# EAGLE design Mainboard (EAGLE 7.7.0)
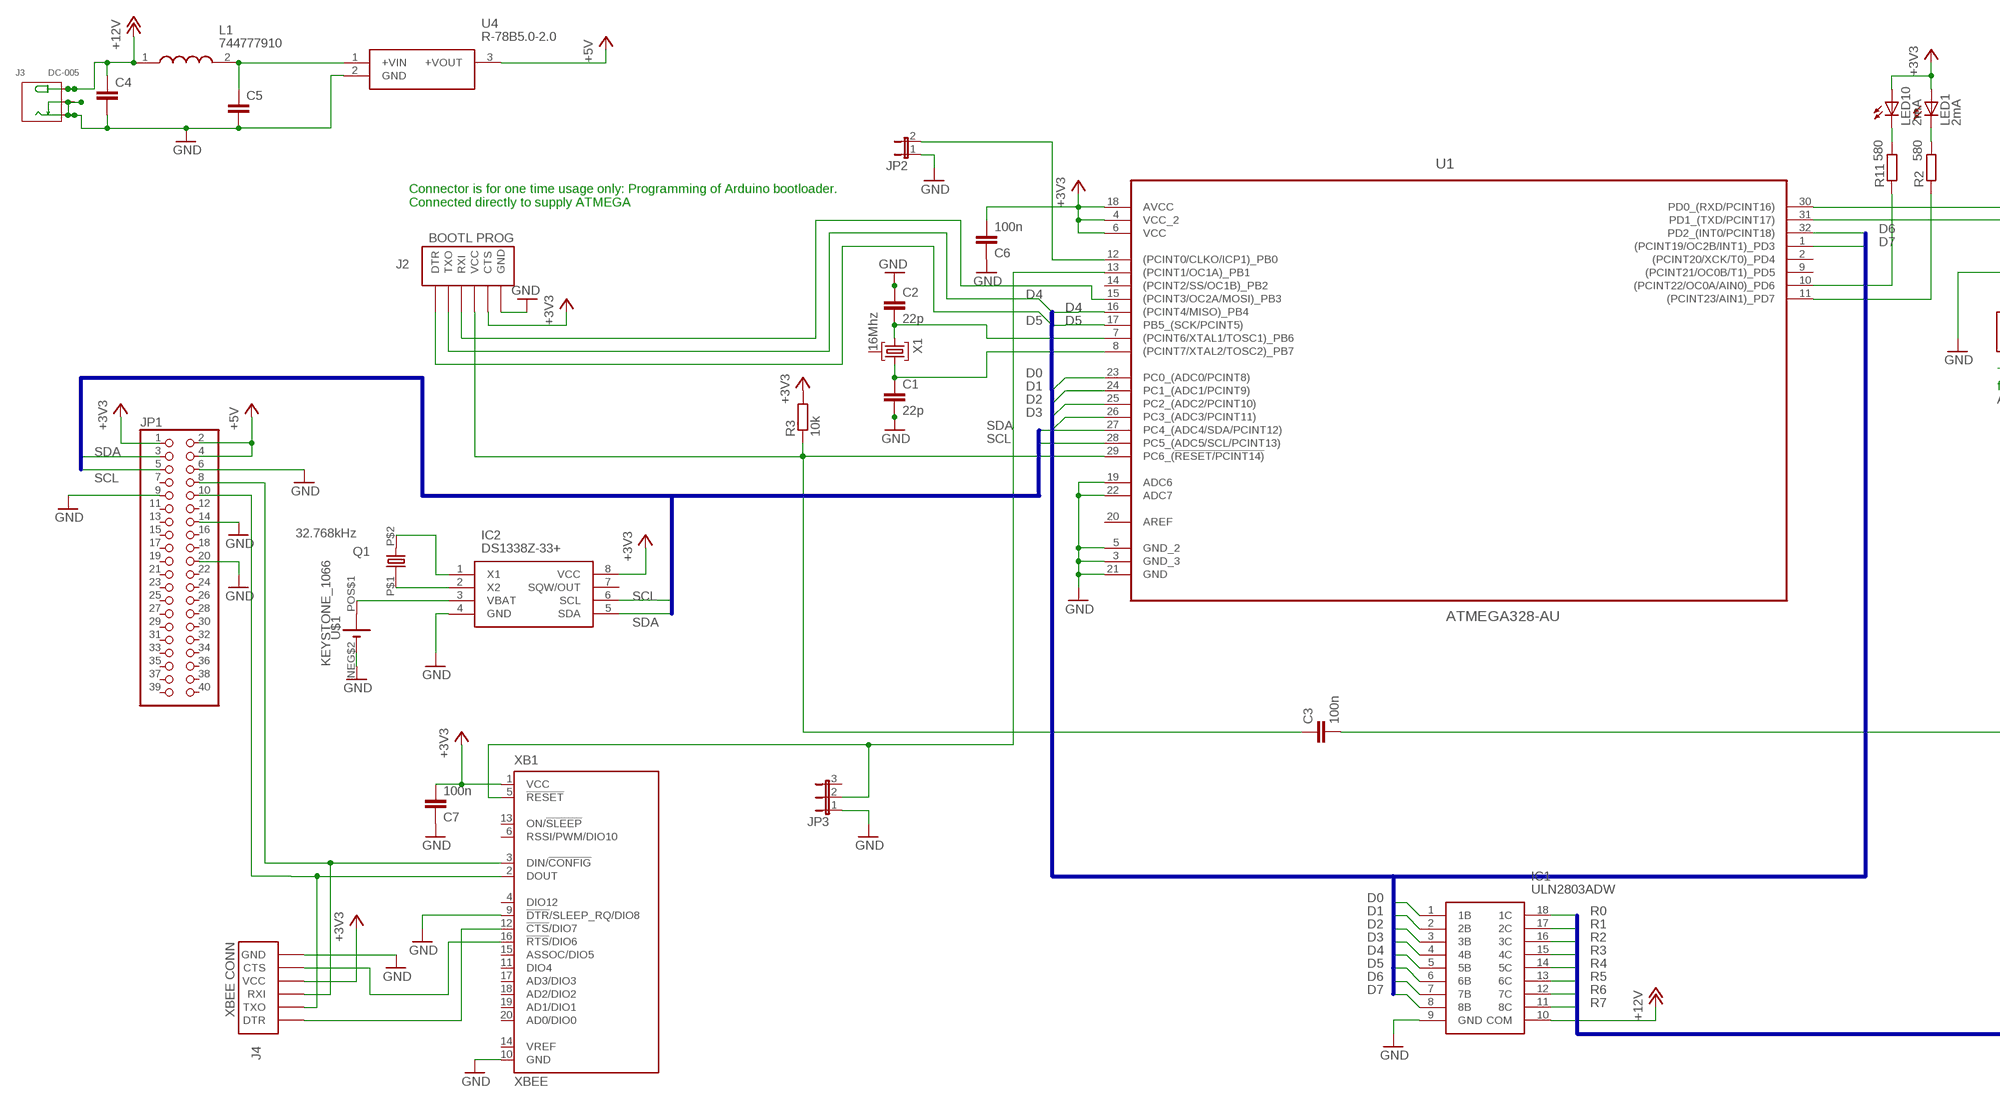
[diagram p0: schematic, sheet 1, part 1 of 2]
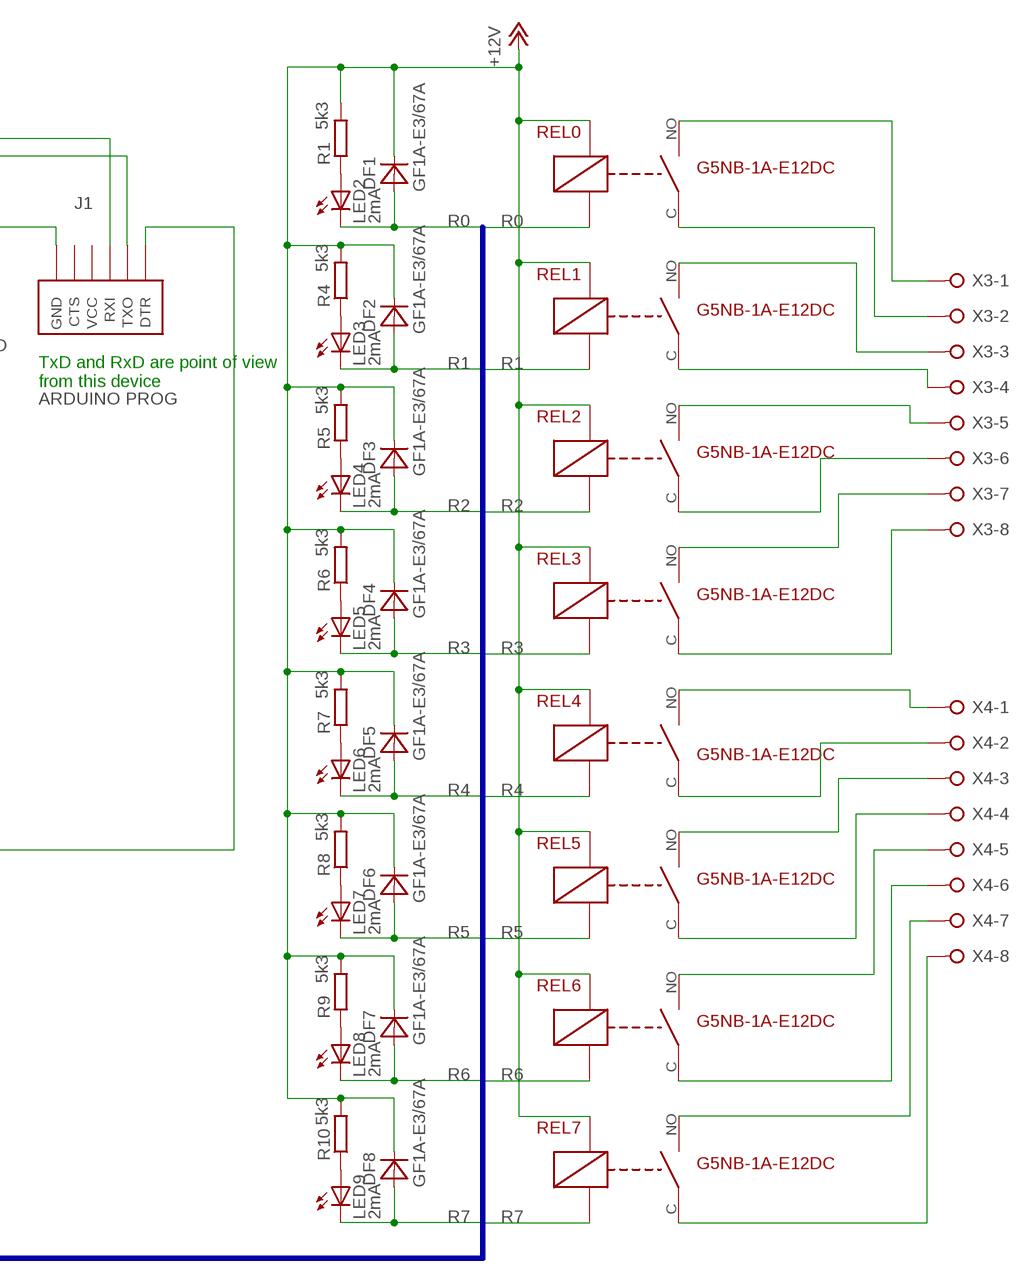
[diagram p1: schematic, sheet 1, part 2 of 2]

## Parts
C1  22p  C-EUC0805  [C0805]
C2  22p  C-EUC0805  [C0805]
C3  100n  C-EUC0805  [C0805]
C4  C-EUC1206  [C1206]
C5  C-EUC1206  [C1206]
C6  100n  C-EUC0805  [C0805]
C7  100n  C-EUC0805  [C0805]
DF1  GF1A-E3/67A  [DO-214BA]
DF2  GF1A-E3/67A  [DO-214BA]
DF3  GF1A-E3/67A  [DO-214BA]
DF4  GF1A-E3/67A  [DO-214BA]
DF5  GF1A-E3/67A  [DO-214BA]
DF6  GF1A-E3/67A  [DO-214BA]
DF7  GF1A-E3/67A  [DO-214BA]
DF8  GF1A-E3/67A  [DO-214BA]
IC1  ULN2803ADW  [SOIC127P1030X265-18N]
IC2  DS1338Z-33+  [SOIC127P600X175-8N]
J1  ARDUINO PROG  FTDI_DEVICE  [FTDI_DEVICE_SIDE]
J2  BOOTL PROG  FTDI_DEVICE  [FTDI_DEVICE_SIDE]
J3  DC-005  CONN-POWER-JACK-2.1MM(DC-005)  [DCJ3P-14.2X11.0X9.0MM]
J4  XBEE CONN  FTDI_DEVICE  [FTDI_DEVICE_SIDE]
JP1  PINHD-2X20  [2X20]
JP2  JUMPER_JP1E  [JUMPER_JP1]
JP3  JP2E  [JP2]
L1  744777910  [WE-PD_7332/7345_PLASTIC_BASE54]
LED1  2mA  LED3MM  [LED3MM]
LED2  2mA  LED3MM  [LED3MM]
LED3  2mA  LED3MM  [LED3MM]
LED4  2mA  LED3MM  [LED3MM]
LED5  2mA  LED3MM  [LED3MM]
LED6  2mA  LED3MM  [LED3MM]
LED7  2mA  LED3MM  [LED3MM]
LED8  2mA  LED3MM  [LED3MM]
LED9  2mA  LED3MM  [LED3MM]
LED10  2mA  LED3MM  [LED3MM]
Q1  32.768kHz  R26-32.768-12.5  [CRYSAL_RADIA_6.2MM]
R1  5k3  R-EU_R0603  [R0603]
R2  580  R-EU_R0603  [R0603]
R3  10k  R-EU_R0805  [R0805]
R4  5k3  R-EU_R0603  [R0603]
R5  5k3  R-EU_R0603  [R0603]
R6  5k3  R-EU_R0603  [R0603]
R7  5k3  R-EU_R0603  [R0603]
R8  5k3  R-EU_R0603  [R0603]
R9  5k3  R-EU_R0603  [R0603]
R10  5k3  R-EU_R0603  [R0603]
R11  580  R-EU_R0603  [R0603]
REL0  G5NB-1A-E12DC  [G5NB-1A]
REL1  G5NB-1A-E12DC  [G5NB-1A]
REL2  G5NB-1A-E12DC  [G5NB-1A]
REL3  G5NB-1A-E12DC  [G5NB-1A]
REL4  G5NB-1A-E12DC  [G5NB-1A]
REL5  G5NB-1A-E12DC  [G5NB-1A]
REL6  G5NB-1A-E12DC  [G5NB-1A]
REL7  G5NB-1A-E12DC  [G5NB-1A]
U1  ATMEGA328-AU  [QFP80P900X900X120-32N]
U4  R-78B5.0-2.0  [R-78B5]
U$1  KEYSTONE_1066  [KEYSTONE1066]
X1  16Mhz  HC49-HC49-3L  [HC49-3L]
X3  W237-08P  [W237-8P]
X4  W237-08P  [W237-8P]
XB1  XBEE  [XBEE]

## Nets
+3V3 [Power]: C6.2 C7.2 IC2.8(VCC) J2.P$5(CTS) J4.P$4(VCC) JP1.1 LED1.A LED10.A R3.2 U1.4(VCC_2) U1.6(VCC) U1.18(AVCC) XB1.1(VCC)
+5V [Power]: JP1.2 JP1.4 U4.3(+VOUT)
+12V [Power]: C4.1 DF1.C DF2.C DF3.C DF4.C DF5.C DF6.C DF7.C DF8.C IC1.10(COM) J3.+ L1.1 R1.2 R4.2 R5.2 R6.2 R7.2 R8.2 R9.2 R10.2 REL0.A1 REL1.A1 REL2.A1 REL3.A1 REL4.A1 REL5.A1 REL6.A1 REL7.A1
D0: IC1.1(1B) U1.23(PC0_(ADC0/PCINT8))
D1: IC1.2(2B) U1.24(PC1_(ADC1/PCINT9))
D2: IC1.3(3B) U1.25(PC2_(ADC2/PCINT10))
D3: IC1.4(4B) U1.26(PC3_(ADC3/PCINT11))
D4: IC1.5(5B) J2.P$2(TXO) U1.16((PCINT4/MISO)_PB4)
D5: IC1.6(6B) J2.P$1(DTR) U1.17(PB5_(SCK/PCINT5))
D6: IC1.7(7B) U1.32(PD2_(INT0/PCINT18))
D7: IC1.8(8B) U1.1((PCINT19/OC2B/INT1)_PD3)
GND [Power]: C1.2 C2.1 C4.2 C5.2 C6.1 C7.1 IC1.9(GND) IC2.4(GND) J1.P$6(GND) J2.P$6(GND) J3.-1(-) J4.P$6(GND) JP1.6 JP1.9 JP1.14 JP1.20 JP2.1 JP3.1 U1.3(GND_3) U1.5(GND_2) U1.19(ADC6) U1.21(GND) U1.22(ADC7) U4.2(GND) U$1.NEG$2(-) XB1.9(!DTR!/SLEEP_RQ/DIO8) XB1.10(GND)
N$1: C2.2 U1.7((PCINT6/XTAL1/TOSC1)_PB6) X1.1
N$2: JP3.2 U1.13((PCINT1/OC1A)_PB1) XB1.5(!RESET)
N$3: J4.P$2(TXO) JP1.10 XB1.2(DOUT)
N$4 [Relay]: REL0.NO X3.1
N$5: C3.2 J1.P$1(DTR)
N$6: C1.1 U1.8((PCINT7/XTAL2/TOSC2)_PB7) X1.3
N$7 [Power]: C5.1 L1.2 U4.1(+VIN)
N$8: R2.1 U1.11((PCINT23/AIN1)_PD7)
N$9: J1.P$3(RXI) U1.30(PD0_(RXD/PCINT16))
N$10: J1.P$2(TXO) U1.31(PD1_(TXD/PCINT17))
N$11: LED1.K(C) R2.2
N$12: IC2.3(VBAT) U$1.POS$1(+)
N$13: J4.P$1(DTR) XB1.12(!CTS!/DIO7)
N$14: IC2.2(X2) Q1.P$1
N$15 [Relay]: REL0.C X3.2
N$16 [Relay]: REL1.NO X3.3
N$17 [Relay]: REL1.C X3.4
N$18 [Relay]: REL2.NO X3.5
N$19 [Relay]: REL2.C X3.6
N$20: C3.1 J2.P$4(VCC) R3.1 U1.29(PC6_(!RESET/PCINT14))
N$21 [Relay]: REL3.NO X3.7
N$22: J2.P$3(RXI) U1.15((PCINT3/OC2A/MOSI)_PB3)
N$23 [Relay]: REL7.NO X4.7
N$24: LED10.K(C) R11.2
N$25 [Relay]: REL3.C X3.8
N$26 [Relay]: REL4.NO X4.1
N$27 [Relay]: REL4.C X4.2
N$28 [Relay]: REL5.NO X4.3
N$29 [Relay]: REL5.C X4.4
N$30 [Relay]: REL6.NO X4.5
N$31 [Relay]: REL6.C X4.6
N$33 [Relay]: REL7.C X4.8
N$34: JP2.2 U1.12((PCINT0/CLKO/ICP1)_PB0)
N$35: J4.P$3(RXI) JP1.8 XB1.3(DIN/!CONFIG)
N$36: LED2.A R1.1
N$37: LED3.A R4.1
N$38: LED4.A R5.1
N$39: LED5.A R6.1
N$40: LED7.A R8.1
N$41: IC2.1(X1) Q1.P$2
N$42: J4.P$5(CTS) XB1.16(!RTS!/DIO6)
N$43: LED6.A R7.1
N$44: R11.1 U1.10((PCINT22/OC0A/AIN0)_PD6)
N$46: LED8.A R9.1
N$48: LED9.A R10.1
R0: DF1.A IC1.18(1C) LED2.K(C) REL0.A2
R1: DF2.A IC1.17(2C) LED3.K(C) REL1.A2
R2: DF3.A IC1.16(3C) LED4.K(C) REL2.A2
R3: DF4.A IC1.15(4C) LED5.K(C) REL3.A2
R4: DF5.A IC1.14(5C) LED6.K(C) REL4.A2
R5: DF6.A IC1.13(6C) LED7.K(C) REL5.A2
R6: DF7.A IC1.12(7C) LED8.K(C) REL6.A2
R7: DF8.A IC1.11(8C) LED9.K(C) REL7.A2
SCL: IC2.6(SCL) JP1.5 U1.28(PC5_(ADC5/SCL/PCINT13))
SDA: IC2.5(SDA) JP1.3 U1.27(PC4_(ADC4/SDA/PCINT12))
Unconnected: IC2.7(SQW/OUT) J1.P$4(VCC) J1.P$5(CTS) J3.-2(CDN) JP1.7 JP1.11 JP1.12 JP1.13 JP1.15 JP1.16 JP1.17 JP1.18 JP1.19 JP1.21 JP1.22 JP1.23 JP1.24 JP1.25 JP1.26 JP1.27 JP1.28 JP1.29 JP1.30 JP1.31 JP1.32 JP1.33 JP1.34 JP1.35 JP1.36 JP1.37 JP1.38 JP1.39 JP1.40 JP3.3 U1.2((PCINT20/XCK/T0)_PD4) U1.9((PCINT21/OC0B/T1)_PD5) U1.14((PCINT2/SS/OC1B)_PB2) U1.20(AREF) X1.2 XB1.4(DIO12) XB1.6(RSSI/PWM/DIO10) XB1.11(DIO4) XB1.13(ON/!SLEEP) XB1.14(VREF) XB1.15(ASSOC/DIO5) XB1.17(AD3/DIO3) XB1.18(AD2/DIO2) XB1.19(AD1/DIO1) XB1.20(AD0/DIO0)

## Buses
D[0..7]
R[0..7]
SCL,SDA

## Notes on the sheet
- Connector is for one time usage only: Programming of Arduino bootloader.
  Connected directly to supply ATMEGA
- TxD and RxD are point of view
  from this device

## Library data of the parts
C1-C7 = rcl:C-EU: CAPACITOR, European symbol
DF1-DF8 = MainboardComponents:GF1A-E3/67A
IC1 = ULN2803ADW:ULN2803ADW: ULN2803ADW, Darlington Transistor Array, NPN 0.5 A 50 V, Octal, 18-Pin, SOIC Source: Datasheet <http://docs-europe.electrocomponents.com/webdocs/139e/0900766b8139e021.pdf>; DESCRIPTION: ULN2803ADW, Darlington Transistor Array, NPN 0.5 A 50 V, Octal, 18-Pin, SOIC; HEIGHT: 2.65mm; MANUFACTURER_NAME: Texas Instruments; MANUFACTURER_PART_NUMBER: ULN2803ADW; RS_PART_NUMBER: 6466311P; SUPPLIER_NAME: RS
IC2 = DS1338Z-33+:DS1338Z-33+: Real Time Clock Serial 56Byte Maxim DS1338Z-33+ Real Time Clock Battery Backup, Calendar, Clock, NV Timekeeping RAM, 56B RAM 8-Pin SOIC Source: Datasheet <http://docs-europe.electrocomponents.com/webdocs/0f62/0900766b80f62fdd.pdf>; DESCRIPTION: Real Time Clock Serial 56Byte Maxim DS1338Z-33+ Real Time Clock Battery Backup, Calendar, Clock, NV Timekeeping RAM, 56B RAM 8-Pin SOIC; HEIGHT: 1.75mm; MANUFACTURER_NAME: Maxim Integrated; MANUFACTURER_PART_NUMBER: DS1338Z-33+; RS_PART_NUMBER: 7327368; SUPPLIER_NAME: RS
J1 J2 J4 = SparkFun-Connectors:FTDI_DEVICE: Connector which mates to FTDI basic or FTDI cable.
J3 = MainboardComponents:CONN-POWER-JACK-2.1MM(DC-005): 320120003; MPN: DC-005
JP1 = pinhead:PINHD-2X20: PIN HEADER
JP2 = MainboardComponents:JUMPER_JP1E: JUMPER
JP3 = jumper:JP2E: JUMPER
L1 = 744777910:744777910: SMD-Shielded Power Inductors WE-PD Source: Datasheet <http://componentsearchengine.com/Datasheets/1/744777910.pdf>; DESCRIPTION: SMD-Shielded Power Inductors WE-PD; HEIGHT: mm; MANUFACTURER_NAME: W&uuml;rth Elektronik; MANUFACTURER_PART_NUMBER: 744777910; RS_PART_NUMBER: 7897126; SUPPLIER_NAME: RS
LED1-LED10 = led:LED: LED OSRAM: - CHIPLED LG R971, LG N971, LY N971, LG Q971, LY Q971, LO R971, LY R971 LH N974, LH R974 LS Q976, LO Q976, LY Q976 LO Q996 - Hyper CHIPLED LW Q18S LB Q993, LB Q99A, LB R99A - SideLED LS A670, LO A670, LY A670, LG A670, LP A670 LB A673, LV A673, LT A673, LW A673 LH A674 LY A675 LS A676, LA A676, LO A676, LY A676, LW A676 LS A679, LY A679, LG A679 - Hyper Micro SIDELED® LS Y876, LA Y876, LO Y876, LY Y876 LT Y87S - SmartLED LW L88C, LW L88S LB L89C, LB L89S, LG L890 LS L89K, LO L89K, LY L89K LS L896, LA L896, LO L896, LY L896 - TOPLED LS T670, LO T670, LY T670, LG T670, LP T670 LSG T670, LSP T670, LSY T670, LOP T670, LYG T670 LG T671, LOG T671, LSG T671 LB T673, LV T673, LT T673, LW T673 LH T674 LS T676, LA T676, LO T676, LY T676, LB T676, LH T676, LSB T676, LW T676 LB T67C, LV T67C, LT T67C, LS T67K, LO T67K, LY T67K, LW E67C LS E67B, LA E67B, LO E67B, LY E67B, LB E67C, LV E67C, LT E67C LW T67C LS T679, LY T679, LG T679 LS T770, LO T770, LY T770, LG T770, LP T770 LB T773, LV T773, LT T773, LW T773 LH T774 LS E675, LA E675, LY E675, LS T675 LS T776, LA T776, LO T776, LY T776, LB T776 LHGB T686 LT T68C, LB T68C - Hyper Mini TOPLED® LB M676 - Mini TOPLED Santana® LG M470 LS M47K, LO M47K, LY M47K Source: http://www.osram.convergy.de LUXEON: - LUMILED® LXK2-PW12-R00, LXK2-PW12-S00, LXK2-PW14-U00, LXK2-PW14-V00 LXK2-PM12-R00, LXK2-PM12-S00, LXK2-PM14-U00 LXK2-PE12-Q00, LXK2-PE12-R00, LXK2-PE12-S00, LXK2-PE14-T00, LXK2-PE14-U00 LXK2-PB12-K00, LXK2-PB12-L00, LXK2-PB12-M00, LXK2-PB14-N00, LXK2-PB14-P00, LXK2-PB14-Q00 LXK2-PR12-L00, LXK2-PR12-M00, LXK2-PR14-Q00, LXK2-PR14-R00 LXK2-PD12-Q00, LXK2-PD12-R00, LXK2-PD12-S00 LXK2-PH12-R00, LXK2-PH12-S00 LXK2-PL12-P00, LXK2-PL12-Q00, LXK2-PL12-R00 Source: www.luxeon.com KINGBRIGHT: KA-3528ASYC Source: www.kingbright.com
Q1 = MainboardComponents:R26-32.768-12.5
R1-R11 = rcl:R-EU_: RESISTOR, European symbol
REL0 REL1-REL7 = MainboardComponents:G5NB-1A-E12DC
U1 = Components:ATMEGA328-AU: MCU, 8BIT, AVR, 32K FLASH, TQFP-32; MF: ATMEL; MPN: ATMEGA328-AU; OC_FARNELL: 1972086; OC_NEWARK: 68T2926; PACKAGE: TQFP-32; SUPPLIER: ATMEL
U4 = R-78B5.0-2.0:R-78B5.0-2.0: RECOM POWER - R-78B5.0-2.0 - DC-DC CONVERTER, 5V, 2A Source: Datasheet <https://www.recom-power.com/pdf/Innoline/R-78Bxx-2.0.pdf>; DESCRIPTION: RECOM POWER - R-78B5.0-2.0 - DC-DC CONVERTER, 5V, 2A; HEIGHT: mm; MANUFACTURER_NAME: RECOM Power; MANUFACTURER_PART_NUMBER: R-78B5.0-2.0; RS_PART_NUMBER: 1392959; SUPPLIER_NAME: RS
U$1 = MainboardComponents:KEYSTONE_1066
X1 = IQD-Frequency-Products:HC49: Crystals; MF: IQD FREQUENCY PRODUCTS; MFD: IQD Frequency Products; MPN: LFXTAL003240; OC_FARNELL: 9713700
X3 X4 = con-wago-508:W237-08P: WAGO SREW CLAMP; OC_FARNELL: unknown; OC_NEWARK: unknown
XB1 = xbee:XBEE: XBee (TM) /XBee-PRO(TM) OEM RF Modules Source: MaxStream, Inc. xbee_productmanual.pdf; MPN: XBP24-Z7UIT-004; OC_FARNELL: 1751799; OC_NEWARK: 34R5507

## Net classes
1 Power: width 0.508 mm
2 Relay: width 1.778 mm

## Board
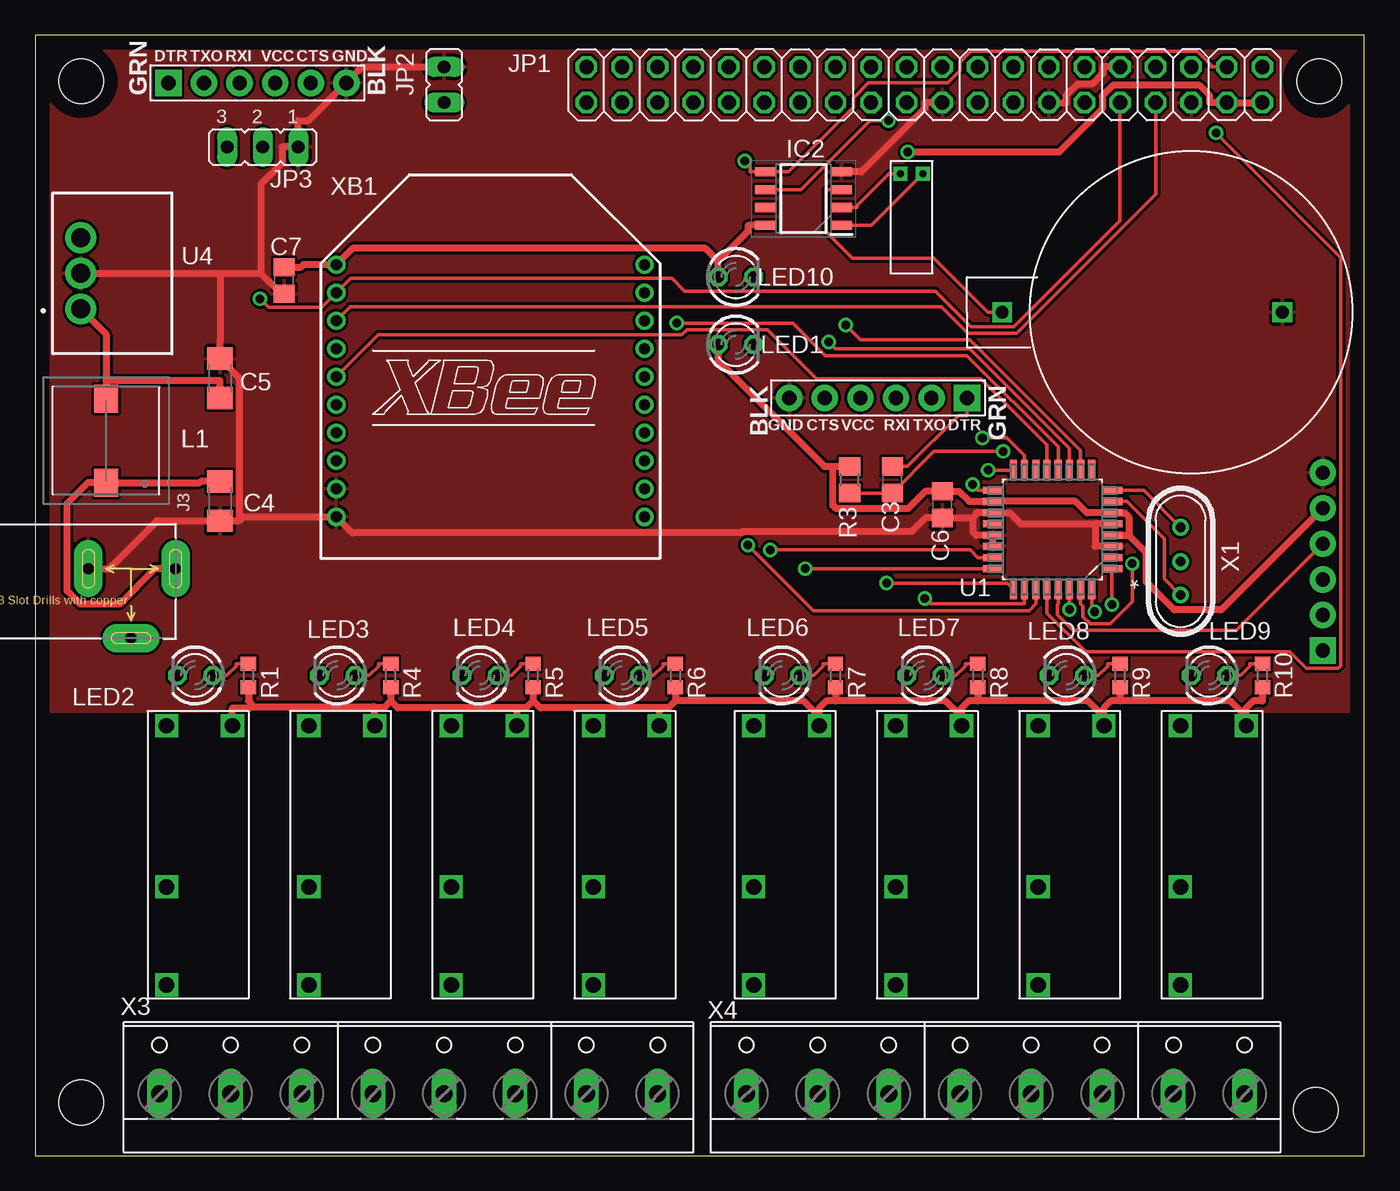
[diagram p2: board, top side]
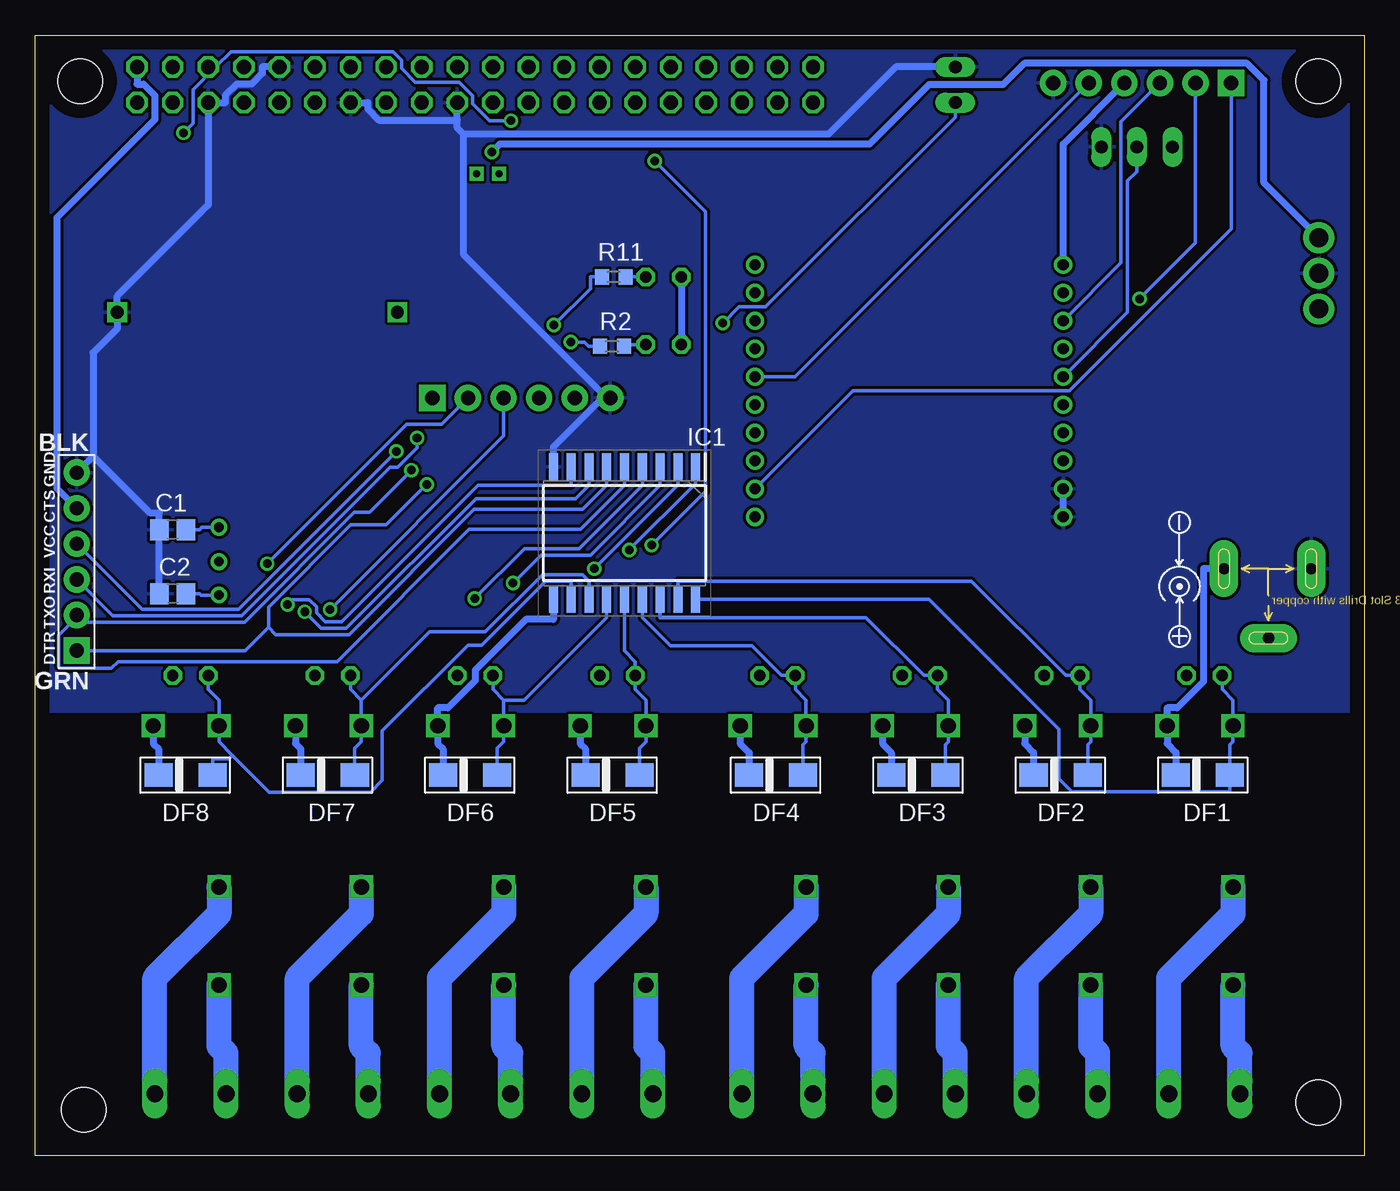
[diagram p3: board, bottom side, seen from below]

Size 94.92 x 80 mm. Coordinates in mm from the lower left corner, seen from the top.
Outline: 0,0 94.92,0 94.92,80 0,80 0,0
Copper layers (1*16): Top 0.035mm / dielectric 1.5mm / Bottom 0.035mm
Design rules "default": minimum track width 10mil, minimum drill 24mil, track to track 8mil, track to pad 8mil, pad to pad 8mil, via to via 8mil, smd to smd 8mil, copper to edge 40mil, drill to drill 8mil, minimum pad ring 10mil, minimum via ring 8mil, stop-mask expansion 4mil, vias tented up to drill 0mil, thermal gap 10mil
Holes 3.2 mm at 3.3,76.71 91.69,76.71 3.3,3.81 91.44,3.3

### Footprints (pad centres in the part's own frame; a part is rotated, then mirrored left to right if it is on the bottom)
C0805 = smd 1.3 x 1.5: 1 -0.95,0; 2 0.95,0
C1206 = smd 1.6 x 1.8: 1 -1.4,0; 2 1.4,0
DO-214BA = smd 2 x 1.676: A 2.084,0 | smd 2 x 1.68: C -1.778,0
SOIC127P1030X265-18N = smd 1.95 x 0.65: 1 -4.725,5.08; 2 -4.725,3.81; 3 -4.725,2.54; 4 -4.725,1.27; 5 -4.725,0; 6 -4.725,-1.27; 7 -4.725,-2.54; 8 -4.725,-3.81; 9 -4.725,-5.08; 10 4.725,-5.08; 11 4.725,-3.81; 12 4.725,-2.54; 13 4.725,-1.27; 14 4.725,0; 15 4.725,1.27; 16 4.725,2.54; 17 4.725,3.81; 18 4.725,5.08
SOIC127P600X175-8N = smd 1.525 x 0.65: 1 -2.712,1.905; 2 -2.712,0.635; 3 -2.712,-0.635; 4 -2.712,-1.905; 5 2.712,-1.905; 6 2.712,-0.635; 7 2.712,0.635; 8 2.712,1.905
FTDI_DEVICE_SIDE = drill 1.016 pad 1.88 square: P$1 -6.35,0 | drill 1.016 pad 1.88: P$2 -3.81,0; P$3 -1.27,0; P$4 1.27,0; P$5 3.81,0; P$6 6.35,0
DCJ3P-14.2X11.0X9.0MM = drill 0.813 pad 2.032 long: + 3.175,0; -1 -3.048,0; -2 0,-4.953
2X20 = drill 1.016 octagon: 1 -24.13,-1.27; 2 -24.13,1.27; 3 -21.59,-1.27; 4 -21.59,1.27; 5 -19.05,-1.27; 6 -19.05,1.27; 7 -16.51,-1.27; 8 -16.51,1.27; 9 -13.97,-1.27; 10 -13.97,1.27; 11 -11.43,-1.27; 12 -11.43,1.27; 13 -8.89,-1.27; 14 -8.89,1.27; 15 -6.35,-1.27; 16 -6.35,1.27; 17 -3.81,-1.27; 18 -3.81,1.27; 19 -1.27,-1.27; 20 -1.27,1.27; 21 1.27,-1.27; 22 1.27,1.27; 23 3.81,-1.27; 24 3.81,1.27; 25 6.35,-1.27; 26 6.35,1.27; 27 8.89,-1.27; 28 8.89,1.27; 29 11.43,-1.27; 30 11.43,1.27; 31 13.97,-1.27; 32 13.97,1.27; 33 16.51,-1.27; 34 16.51,1.27; 35 19.05,-1.27; 36 19.05,1.27; 37 21.59,-1.27; 38 21.59,1.27; 39 24.13,-1.27; 40 24.13,1.27
JUMPER_JP1 = drill 0.914 long: 1 0,-1.27; 2 0,1.27
JP2 = drill 0.914 long: 1 -2.54,0; 2 0,0; 3 2.54,0
WE-PD_7332/7345_PLASTIC_BASE54 = smd 1.7 x 2: 1 0,3; 2 0,-3
LED3MM = drill 0.813 octagon: A -1.27,0; K 1.27,0
CRYSAL_RADIA_6.2MM = drill 0.5 square: P$1 0.7,-0.9; P$2 2.3,-0.9
R0603 = smd 1 x 1.1: 1 -0.85,0; 2 0.85,0
R0805 = smd 1.3 x 1.5: 1 -0.95,0; 2 0.95,0
G5NB-1A = drill 1.1 square: A1 1.05,-1.15; A2 1.05,-5.85; C 12.55,-5.85; NO 19.55,-5.85
QFP80P900X900X120-32N = smd 1.473 x 0.508: 1 -4.242,2.794; 2 -4.242,2.007; 3 -4.242,1.194; 4 -4.242,0.406; 5 -4.242,-0.406; 6 -4.242,-1.194; 7 -4.242,-2.007; 8 -4.242,-2.794; 17 4.242,-2.794; 18 4.242,-2.007; 19 4.242,-1.194; 20 4.242,-0.406; 21 4.242,0.406; 22 4.242,1.194; 23 4.242,2.007; 24 4.242,2.794 | smd 0.508 x 1.473: 9 -2.794,-4.242; 10 -2.007,-4.242; 11 -1.194,-4.242; 12 -0.406,-4.242; 13 0.406,-4.242; 14 1.194,-4.242; 15 2.007,-4.242; 16 2.794,-4.242; 25 2.794,4.242; 26 2.007,4.242; 27 1.194,4.242; 28 0.406,4.242; 29 -0.406,4.242; 30 -1.194,4.242; 31 -2.007,4.242; 32 -2.794,4.242
R-78B5 = drill 1.35 pad 2.2: 1 -2.54,-2; 2 0,-2; 3 2.54,-2
KEYSTONE1066 = drill 0.9 square: NEG$2 -6.5,0; POS$1 13.5,0
HC49-3L = drill 0.7 pad 1.2: 1 -2.413,0; 2 -0.027,0; 3 2.413,0
W237-8P = drill 1.194 long: 1 -17.78,-0.635; 2 -12.7,-0.635; 3 -7.62,-0.635; 4 -2.54,-0.635; 5 2.54,-0.635; 6 7.62,-0.635; 7 12.7,-0.635; 8 17.78,-0.635
XBEE = drill 0.8 pad 1.27: 1 -11,9; 2 -11,7; 3 -11,5; 4 -11,3; 5 -11,1; 6 -11,-1; 7 -11,-3; 8 -11,-5; 9 -11,-7; 10 -11,-9; 11 11,-9; 12 11,-7; 13 11,-5; 14 11,-3; 15 11,-1; 16 11,1; 17 11,3; 18 11,5; 19 11,7; 20 11,9

### Placement (x,y rotation side)
C1  85.09,44.7 180 bottom
C2  85.09,40.13 0 bottom
C3  61.21,48.26 90 top
C4  13.21,46.74 270 top
C5  13.21,55.5 90 top
C6  64.77,46.48 90 top
C7  17.78,62.48 90 top
DF1  11.68,27.18 0 bottom
DF2  21.84,27.18 0 bottom
DF3  32,27.18 0 bottom
DF4  42.16,27.18 0 bottom
DF5  53.85,27.18 0 bottom
DF6  64.01,27.18 0 bottom
DF7  74.17,27.18 0 bottom
DF8  84.33,27.18 0 bottom
IC1  52.83,44.45 270 bottom
IC2  54.86,68.33 180 top
J1  60.2,54.1 180 top
J2  91.95,42.42 90 bottom
J3  6.86,41.91 0 top
J4  15.87,76.58 0 top
JP1  63.5,76.45 180 top
JP2  29.21,76.45 180 top
JP3  16.26,72.01 180 top
L1  5.08,51.05 180 top
LED1  50.04,57.91 0 top
LED2  11.43,34.29 180 top
LED3  21.59,34.29 180 top
LED4  31.75,34.29 180 top
LED5  41.91,34.29 180 top
LED6  53.34,34.29 180 top
LED7  63.5,34.29 180 top
LED8  73.66,34.29 180 top
LED9  83.82,34.29 180 top
LED10  50.04,62.74 0 top
Q1  61.09,70.99 0 top
R1  15.24,34.29 270 top
R2  53.72,57.78 0 bottom
R3  58.17,48.26 90 top
R4  25.4,34.29 270 top
R5  35.56,34.29 270 top
R6  45.72,34.29 270 top
R7  57.15,34.29 270 top
R8  67.31,34.29 270 top
R9  77.47,34.29 270 top
R10  87.63,34.29 270 top
R11  53.59,62.74 0 bottom
REL0  15.24,31.75 270 top
REL1  25.4,31.75 270 top
REL2  35.56,31.75 270 top
REL3  45.72,31.75 270 top
REL4  57.15,31.75 270 top
REL5  67.31,31.75 270 top
REL6  77.47,31.75 270 top
REL7  87.63,31.75 270 top
U1  72.64,44.7 180 top
U4  1.27,62.99 90 top
U$1  82.55,60.21 180 top
X1  81.79,42.45 90 top
X3  26.67,5.08 0 top
X4  68.58,5.08 0 top
XB1  32.51,54.61 0 top

### Tracks (layer width: path | path; a pad name or v marks a point on that pad's centre or on a via)
+3V3
  Top 0.508: 56.96,49.21 R3.2 | 56.96,49.21 56.35,49.21 48.77,56.79 LED1.A | 56.96,49.21 56.96,46.44 57.19,46.2 62.33,46.2 63.56,47.43 C6.2 64.92,47.43 65.98,47.43 66.7,46.71 U1.18 74.29,46.71 75.11,45.9 U1.6 77.81,45.9 78.08,45.63 78.08,44.3 | 48.77,63.86 47.86,64.77 22.67,64.77 XB1.1 19.16,63.61 18.99,63.43 C7.2 | J2.P$5 84.69,38.97 81.34,38.97 79.34,40.97 79.34,43.04 78.08,44.3 | IC2.8 50.93,66.42 50.93,66.02 48.77,63.86 | LED10.A 48.77,63.86 | U1.4 78.08,44.3
  Bottom 0.508: XB1.1 21.51,72.21 J4.P$4 | JP1.1 87.63,76.5 87.17,76.5 86.36,75.69 86.36,73.97 93.36,66.96 93.36,47.65 J2.P$5 | LED10.A LED1.A
+5V  (via drill 0.61 pad 1.02)
  Top 0.508: v62.31,71.64 73.12,71.64 76.2,74.73 76.2,75.65 76.95,76.4 83.16,76.4 83.87,75.69 83.87,75.18 JP1.4 JP1.2
  Bottom 0.508: U4.3 7.19,69.45 7.19,76.78 8.39,77.98 24.28,77.98 25.82,76.45 31.09,76.45 35.34,72.21 61.75,72.21 v62.31,71.64
+12V
  Top 0.508: 24.25,32.03 24.95,32.03 25.4,32.48 | 15.46,32.07 24.2,32.07 24.25,32.03 | 24.25,32.03 24.25,31.98 REL1.A1 | 34.41,31.98 25.9,31.98 25.4,32.48 | 35.56,32.48 35.06,31.98 34.41,31.98 | 34.41,31.98 | R4.2 25.4,32.48 | REL2.A1 34.41,31.98 | 44.57,31.98 36.06,31.98 35.56,32.48 | 15.46,32.07 15.46,32.26 15.24,32.48 R1.2 | 15.46,32.07 15.37,31.98 14.09,31.98 REL0.A1 | J3.+ 8.56,41.91 6.03,39.38 3.23,39.38 2.29,40.32 2.29,46.57 3.77,48.05 L1.1 11.77,48.05 11.85,48.14 C4.1 | R5.2 35.56,32.48 | 45.72,32.48 45.22,31.98 44.57,31.98 | 56,31.34 54.86,32.48 45.72,32.48 | REL3.A1 44.57,31.98 | 56,31.34 56,31.98 56.5,32.48 57.15,32.48 57.15,32.49 | REL4.A1 56,31.34 | R7.2 57.15,32.49 | 66.16,31.34 65.02,32.49 57.15,32.49 | 66.16,31.34 66.16,31.98 66.66,32.48 67.31,32.48 67.31,32.49 | REL5.A1 66.16,31.34 | R8.2 67.31,32.49 | 76.32,31.34 75.18,32.49 67.31,32.49 | 76.32,31.34 76.32,31.98 76.82,32.48 77.47,32.48 77.47,32.49 | REL6.A1 76.32,31.34 | R9.2 77.47,32.49 | 86.48,31.34 85.34,32.49 77.47,32.49 | 86.48,31.34 86.48,31.98 86.98,32.48 87.63,32.48 R10.2 | REL7.A1 86.48,31.34 | R6.2 45.72,32.48
  Bottom 0.508: IC1.10 57.91,38.29 59.88,38.29 63.5,34.67 63.5,33.92 65.44,31.98 66.16,31.98 REL5.A1 66.16,29.42 65.79,29.04 DF6.C | J3.+ 11.51,41.91 11.51,33.84 13.37,31.98 14.09,31.98 REL0.A1 14.09,29.42 13.46,28.79 DF1.C | REL1.A1 24.25,29.42 23.62,28.79 DF2.C | REL2.A1 34.41,29.42 33.78,28.79 DF3.C | REL3.A1 44.57,29.42 43.94,28.79 DF4.C | REL4.A1 56,29.42 55.63,29.04 DF5.C | REL6.A1 76.32,29.42 75.95,29.04 DF7.C | REL7.A1 86.48,29.42 86.11,29.04 DF8.C
D0  (via drill 0.61 pad 1.02)
  Top 0.254: U1.23 67.34,42.7 66.78,43.25 v52.5,43.25
  Bottom 0.254: IC1.1 47.75,47.87 47.88,47.87 v52.5,43.25
D1  (via drill 0.61 pad 1.02)
  Top 0.254: v54.98,41.91 67.34,41.91 U1.24
  Bottom 0.254: v54.98,41.91 54.98,41.95 49.07,47.87 49.02,47.87 IC1.2
D2  (via drill 0.61 pad 1.02)
  Top 0.254: U1.25 69.43,40.88 v60.79,40.88
  Bottom 0.254: v60.79,40.88 58.79,42.89 55.27,42.89 50.29,47.87 IC1.3
D3  (via drill 0.61 pad 1.02)
  Top 0.254: U1.26 70.64,39.4 63.93,39.4 v63.53,39.79
  Bottom 0.254: IC1.4 51.56,47.87 56.09,43.35 59.98,43.35 v63.53,39.79
D4  (via drill 0.61 pad 1.02)
  Top 0.254: U1.16 v68.05,48.95
  Bottom 0.254: 91.95,38.22 92.17,38.22 93.22,37.17 93.22,34.95 93.07,34.8 89.48,34.8 89,35.28 73.36,35.28 63.93,44.72 55.98,44.72 52.83,47.87 IC1.5 | v68.05,48.95 71.05,45.95 72.12,45.95 79.96,38.11 91.83,38.11 91.95,38.22 | J2.P$2 91.95,38.22
D5  (via drill 0.61 pad 1.02)
  Top 0.254: v66.95,47.92 67.34,47.53 67.34,47.5 U1.17
  Bottom 0.254: 78.25,37.73 77.74,37.21 72.5,37.21 63.56,46.15 55.82,46.15 54.1,47.87 IC1.6 | 78.25,37.73 78.25,39.17 72.39,45.03 69.84,45.03 v66.95,47.92 | 78.25,37.73 79.91,36.07 J2.P$1
D6  (via drill 0.61 pad 1.02)
  Top 0.254: U1.32 75.44,39.07 v75.67,38.84
  Bottom 0.254: v75.67,38.84 74.5,37.67 72.69,37.67 63.44,46.92 56.32,46.92 55.37,47.87 IC1.7
D7  (via drill 0.61 pad 1.02)
  Top 0.254: U1.1 v76.89,39.35
  Bottom 0.254: v76.89,39.35 76.53,39.71 75.34,39.71 74.83,39.19 74.83,38.77 74.19,38.13 73.02,38.13 63.28,47.87 56.64,47.87 IC1.8
GND
  Top 0.508: 75.69,45.11 70.38,45.11 69.6,45.9 U1.19 67.21,45.9 67.21,45.79 66.95,45.53 | U1.22 U1.21 67.21,44.3 66.95,44.55 66.95,45.53 | 66.95,45.53 65.98,45.53 C6.1 63.56,45.53 62.59,44.56 50.5,44.56 50.41,44.48 22.65,44.48 XB1.10 14.84,45.61 14.56,45.34 | JP2.1 23.37,77.72 J4.P$6 19.53,73.89 18.8,73.89 18.8,72.35 JP3.1 17.63,72.01 17.63,70.84 16.12,69.33 16.12,62.99 | JP1.20 63.55,75.18 63.55,74.77 59.01,70.23 IC2.4 | 13.21,62.99 16.12,62.99 | U4.2 13.21,62.99 | 13.21,62.99 13.21,58.16 C5.2 14.56,55.54 14.56,45.34 | 16.12,62.99 17.58,61.53 C7.1 | U1.5 75.69,45.11 | 75.69,45.11 75.69,43.51 76.29,43.51 U1.3 | 14.56,45.34 C4.2 8.71,45.34 5.28,41.91 J3.-1 | JP1.14 73.61,75.18 73.61,75.69 74.42,76.5 75.49,76.5 76.25,77.27 76.25,77.72 JP1.9
  Bottom 0.508: 64.32,72.92 64.77,73.37 64.77,73.93 | JP2.1 33.47,77.72 38.27,72.92 64.32,72.92 | 64.32,72.92 64.35,72.89 64.35,64.37 54.25,54.27 | IC1.9 57.91,50.61 54.25,54.27 | 54.25,54.27 54.08,54.1 J1.P$6 | 64.77,73.93 JP1.20 | 64.77,73.93 70.38,73.93 71.17,74.73 71.17,75.18 JP1.14 | JP1.9 78.69,77.72 78.69,77.27 79.45,76.5 80.52,76.5 81.33,75.69 81.33,75.18 JP1.6 82.55,73.97 82.55,67.88 89.05,61.38 U$1.NEG$2 89.05,59.05 90.77,57.34 90.77,49.95 | C2.1 C1.2 86.04,45.91 86.73,45.91 90.77,49.95 | J2.P$6 90.77,49.95 | XB1.10 XB1.9
  pour Top: 0,80.01 95.25,80.01 95.25,31.75 0,31.75
  pour Bottom: 0,80.01 95.25,80.01 95.25,31.75 0,31.75
N$1
  Top 0.254: U1.7 77.95,46.71 80.63,44.04 80.63,41.2 X1.1
  Bottom 0.254: C2.2 83.16,40.13 83.06,40.03 X1.1
N$2
  Top 0.254: XB1.5 24.5,58.6 46.16,58.6 46.55,58.98 52.3,58.98 55.81,55.48 67.53,55.48 72.24,50.76 U1.13
  Bottom 0.254: JP3.2 16.26,70.26 16.92,69.59 16.92,60.2 XB1.5
N$3  (via drill 0.61 pad 1.02)
  Top 0.254: v16.06,61.17 16.68,60.55 20.46,60.55 XB1.2 22.53,62.63 45.48,62.63 46.37,61.73 64.29,61.73 66.84,59.18 69.91,59.18 77.47,66.74 JP1.10
  Bottom 0.254: v16.06,61.17 12.06,65.17 J4.P$2
N$4
  Bottom 1.778: X3.1 8.89,7.33 9.39,7.83 REL0.NO
N$5
  Top 0.254: J1.P$1 66.55,52.83 65.92,52.83 62.29,49.21 C3.2
N$6
  Top 0.254: X1.3 79.15,47.5 U1.8
  Bottom 0.254: C1.1 83.16,44.7 83,44.86 X1.3
N$7
  Top 0.508: 5.08,55.36 L1.2 | U4.1 5.08,58.64 5.08,55.36 | 5.08,55.36 13.21,55.36 C5.1
N$8  (via drill 0.61 pad 1.02)
  Top 0.254: v56.67,58.09 57.15,57.6 66.76,57.6 73.84,50.52 73.84,50.01 U1.11
  Bottom 0.254: v56.67,58.09 55.7,58.09 55.4,57.78 R2.1
N$9  (via drill 0.61 pad 1.02)
  Top 0.254: U1.30 73.84,39.02 v73.86,39
  Bottom 0.254: J1.P$3 61.47,51.39 v73.86,39
N$10  (via drill 0.61 pad 1.02)
  Top 0.254: v78.34,42.27 78.34,39.55 76.78,37.98 75.34,37.98 74.83,38.49 74.83,39.22 74.65,39.4 U1.31
  Bottom 0.254: J1.P$2 65.88,52.23 68.38,52.23 v78.34,42.27
N$11
  Bottom 0.254: LED1.K 52.3,57.91 52.43,57.78 R2.2
N$12
  Top 0.254: IC2.3 56.48,68.96 56.48,65.95 58.37,64.06 64.17,64.06 68.02,60.21 U$1.POS$1
N$13
  Bottom 0.254: XB1.12 36.51,54.61 21.08,54.61 9.53,66.17 J4.P$1
N$14
  Top 0.254: IC2.2 58.67,67.69 58.67,67.81 60.95,70.09 Q1.P$1
N$15
  Bottom 1.778: REL0.C 9.39,17.28 13.97,12.7 X3.2
N$16
  Bottom 1.778: X3.3 19.05,7.33 19.55,7.83 REL1.NO
N$17
  Bottom 1.778: REL1.C 19.55,17.28 24.13,12.7 X3.4
N$18
  Bottom 1.778: X3.5 29.21,7.33 29.71,7.83 REL2.NO
N$19
  Bottom 1.778: REL2.C 29.71,17.28 34.29,12.7 X3.6
N$20  (via drill 0.61 pad 1.02)
  Top 0.254: J2.P$4 85.79,37.53 74.11,37.53 72.99,38.64 72.99,39.34 73.05,39.4 U1.29 | v69.11,50.29 64.19,50.29 C3.1 59.25,47.31 R3.1
  Bottom 0.254: J2.P$4 87.28,39.02 80.38,39.02 v69.11,50.29
N$21
  Bottom 1.778: X3.7 39.37,7.33 39.87,7.83 REL3.NO
N$22  (via drill 0.61 pad 1.02)
  Top 0.254: U1.15 70.64,50.01 69.4,51.25 v67.64,51.25
  Bottom 0.254: J2.P$3 89.36,38.56 80.15,38.56 69.55,49.16 69.02,49.16 67.64,50.54 v67.64,51.25
N$23
  Bottom 1.778: X4.7 81.28,7.33 81.78,7.83 REL7.NO
N$24
  Bottom 0.254: R11.2 LED10.K
N$25
  Bottom 1.778: REL3.C 39.87,17.28 44.45,12.7 X3.8
N$26
  Bottom 1.778: X4.1 50.8,7.33 51.3,7.83 REL4.NO
N$27
  Bottom 1.778: REL4.C 51.3,17.28 55.88,12.7 X4.2
N$28
  Bottom 1.778: X4.3 60.96,7.33 61.46,7.83 REL5.NO
N$29
  Bottom 1.778: REL5.C 61.46,17.28 66.04,12.7 X4.4
N$30
  Bottom 1.778: X4.5 71.12,7.33 71.62,7.83 REL6.NO
N$31
  Bottom 1.778: REL6.C 71.62,17.28 76.2,12.7 X4.6
N$33
  Bottom 1.778: REL7.C 81.78,17.28 86.36,12.7 X4.8
N$34  (via drill 0.61 pad 1.02)
  Top 0.254: U1.12 73.05,50.6 66.53,57.12 56.43,57.12 54.1,59.44 v45.82,59.44
  Bottom 0.254: JP2.2 29.21,74.14 42.76,60.59 44.66,60.59 v45.82,59.44
N$35
  Top 0.254: XB1.3 22.51,60.61 64.72,60.61 66.61,58.72 70.09,58.72 80.01,68.64 JP1.8
  Bottom 0.254: XB1.3 17.38,63.74 17.38,73.81 J4.P$3
N$36
  Top 0.254: R1.1 14.36,35.14 14.36,34.96 13.69,34.29 LED2.A
N$37
  Top 0.254: R4.1 24.52,35.14 24.52,34.96 23.85,34.29 LED3.A
N$38
  Top 0.254: R5.1 34.68,35.14 34.68,34.96 34.01,34.29 LED4.A
N$39
  Top 0.254: R6.1 44.84,35.14 44.84,34.96 44.17,34.29 LED5.A
N$40
  Top 0.254: R8.1 66.43,35.14 66.43,34.96 65.76,34.29 LED7.A
N$41
  Top 0.254: Q1.P$2 59.72,66.42 IC2.1
N$42
  Bottom 0.254: XB1.16 40.66,55.61 J4.P$5
N$43
  Top 0.254: R7.1 56.27,35.14 56.27,34.96 55.6,34.29 LED6.A
N$44  (via drill 0.61 pad 1.02)
  Top 0.254: v57.88,59.3 58.92,58.27 66.74,58.27 74.65,50.35 74.65,50.01 U1.10
  Bottom 0.254: v57.88,59.3 55.27,61.91 55.27,62.74 R11.1
N$46
  Top 0.254: R9.1 76.59,35.14 76.59,34.96 75.92,34.29 LED8.A
N$48
  Top 0.254: R10.1 86.75,35.14 86.75,34.96 86.08,34.29 LED9.A
R0
  Bottom 0.254: IC1.18 31.11,39.73 21.83,30.44 21.83,26.92 20.9,26 9.61,26 9.6,26.01 DF1.A 9.6,29.34 9.39,29.55 REL0.A2 9.39,32.53 10.16,33.3 LED2.K
R1
  Bottom 0.254: DF2.A 19.76,29.34 19.55,29.55 REL1.A2 19.55,32.53 20.32,33.3 LED3.K 21.31,34.29 28.05,41.03 49.02,41.03 IC1.17
R2
  Bottom 0.254: IC1.16 50.29,38.42 35.6,38.42 31.47,34.29 LED4.K 30.48,33.3 29.71,32.53 REL2.A2 29.71,29.55 29.92,29.34 DF3.A
R3
  Bottom 0.254: IC1.15 51.56,38.42 49.54,36.4 43.74,36.4 41.63,34.29 LED5.K 40.64,33.3 39.87,32.53 REL3.A2 39.87,29.55 40.08,29.34 DF4.A
R4
  Bottom 0.254: IC1.14 52.83,36.04 52.07,35.28 LED6.K 52.07,33.3 51.3,32.53 REL4.A2 51.3,29.55 51.76,29.08 DF5.A
R5
  Bottom 0.254: 61.46,32.53 59.99,32.53 54.1,38.42 IC1.13 | 61.46,32.53 REL5.A2 61.46,29.55 61.92,29.08 DF6.A | 61.46,32.53 62.23,33.3 LED7.K
R6
  Bottom 0.254: 71.62,32.53 66.75,37.4 62.78,37.4 58.69,41.49 55.83,41.49 55.37,41.03 IC1.12 | 71.62,32.53 REL6.A2 71.62,29.55 72.08,29.08 DF7.A | 71.62,32.53 72.39,33.3 LED8.K
R7
  Bottom 0.254: 80.83,28.59 78.21,25.97 70.95,25.97 70.13,26.8 70.13,30.34 64.01,36.46 63.04,36.46 58.47,41.03 56.64,41.03 IC1.11 | DF8.A 82.24,28.35 81.08,28.35 80.83,28.59 | 80.83,28.59 81.78,29.55 81.78,29.66 REL7.A2 81.78,32.53 82.55,33.3 LED9.K
SCL  (via drill 0.61 pad 1.02)
  Top 0.254: v60.94,73.89 59.61,73.89 54.69,68.96 IC2.6 | v84.32,73.02 93.23,64.11 93.23,34.98 93.05,34.8 90.77,34.8 89.59,35.97 75.01,35.97 72.24,38.74 U1.28
  Bottom 0.254: 82,77.72 80.91,78.82 69.37,78.82 68.76,78.2 68.76,77.61 67.77,76.63 64.66,76.63 63.68,75.65 63.68,75.08 62.48,73.89 v60.94,73.89 | v84.32,73.02 83.64,73.69 83.64,76.08 82,77.72 | JP1.5 82,77.72
SDA  (via drill 0.61 pad 1.02)
  Top 0.254: U1.27 71.45,39.4 70.98,38.92 55.56,38.92 v50.9,43.59 | v50.68,71.02 51.06,70.63 51.06,70.23 IC2.5 53.8,70.23 58.42,74.85 58.42,75.5 59.5,76.58 65.18,76.58 66.04,77.44 66.04,78.05 66.84,78.85 82.99,78.85 84,77.84 84,77.72 JP1.3
  Bottom 0.254: v50.9,43.59 47.07,47.42 47.07,67.4 v50.68,71.02